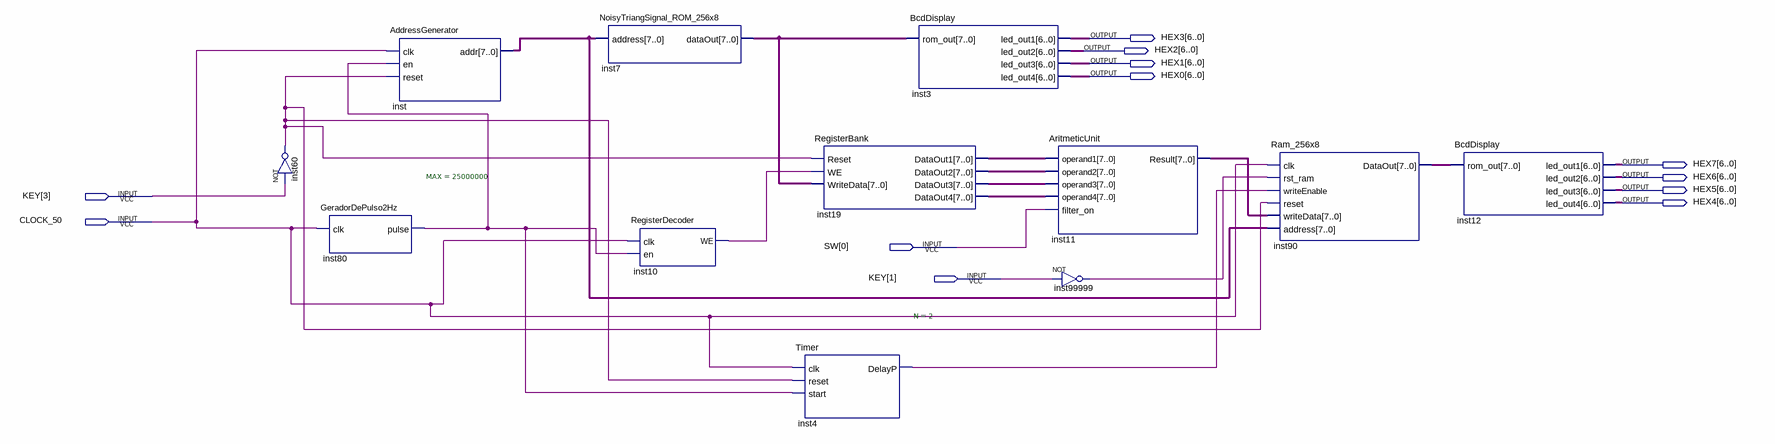
[diagram p0: schematic sheet]
// Quartus schematic TESTEdisplay.bdf as structural Verilog: 12 symbols, 12 pins
module TESTEdisplay (
  input  [3:1] KEY,
  input  CLOCK_50,
  input  [0:0] SW,
  output [6:0] HEX3,
  output [6:0] HEX2,
  output [6:0] HEX1,
  output [6:0] HEX0,
  output [6:0] HEX7,
  output [6:0] HEX6,
  output [6:0] HEX5,
  output [6:0] HEX4
);

  wire inst4_delayp, inst10_we, inst60_out, inst80_pulse, inst99999_out;
  wire [7:0] inst7_dataout, inst11_result, inst19_dataout1, inst19_dataout2, inst19_dataout3,
       inst19_dataout4, inst90_dataout, inst_addr;

  not inst60 (inst60_out, KEY[3]);
  GeradorDePulso2Hz #(.MAX(25000000)) inst80 (.clk(CLOCK_50), .pulse(inst80_pulse));
  AddressGenerator inst (.clk(CLOCK_50), .en(inst80_pulse), .reset(inst60_out), .addr(inst_addr));
  NoisyTriangSignal_ROM_256x8 inst7 (.address(inst_addr), .dataOut(inst7_dataout));
  RegisterDecoder inst10 (.clk(CLOCK_50), .en(inst80_pulse), .WE(inst10_we));
  Timer #(.N(2)) inst4 (.clk(CLOCK_50), .reset(inst60_out), .start(inst80_pulse), .DelayP(inst4_delayp));
  RegisterBank inst19 (
    .Reset(inst60_out), .WE(inst10_we), .WriteData(inst7_dataout), .DataOut1(inst19_dataout1),
    .DataOut2(inst19_dataout2), .DataOut3(inst19_dataout3), .DataOut4(inst19_dataout4));
  BcdDisplay inst3 (.rom_out(inst7_dataout), .led_out1(HEX3), .led_out2(HEX2), .led_out3(HEX1), .led_out4(HEX0));
  AritmeticUnit inst11 (
    .operand1(inst19_dataout1), .operand2(inst19_dataout2), .operand3(inst19_dataout3),
    .operand4(inst19_dataout4), .filter_on(SW[0]), .Result(inst11_result));
  not inst99999 (inst99999_out, KEY[1]);
  Ram_256x8 inst90 (
    .clk(CLOCK_50), .rst_ram(inst99999_out), .writeEnable(inst4_delayp), .reset(inst60_out),
    .writeData(inst11_result), .address(inst_addr), .DataOut(inst90_dataout));
  BcdDisplay inst12 (.rom_out(inst90_dataout), .led_out1(HEX7), .led_out2(HEX6), .led_out3(HEX5), .led_out4(HEX4));
endmodule
